# EAGLE schematic sbc (EAGLE 7.5.0)
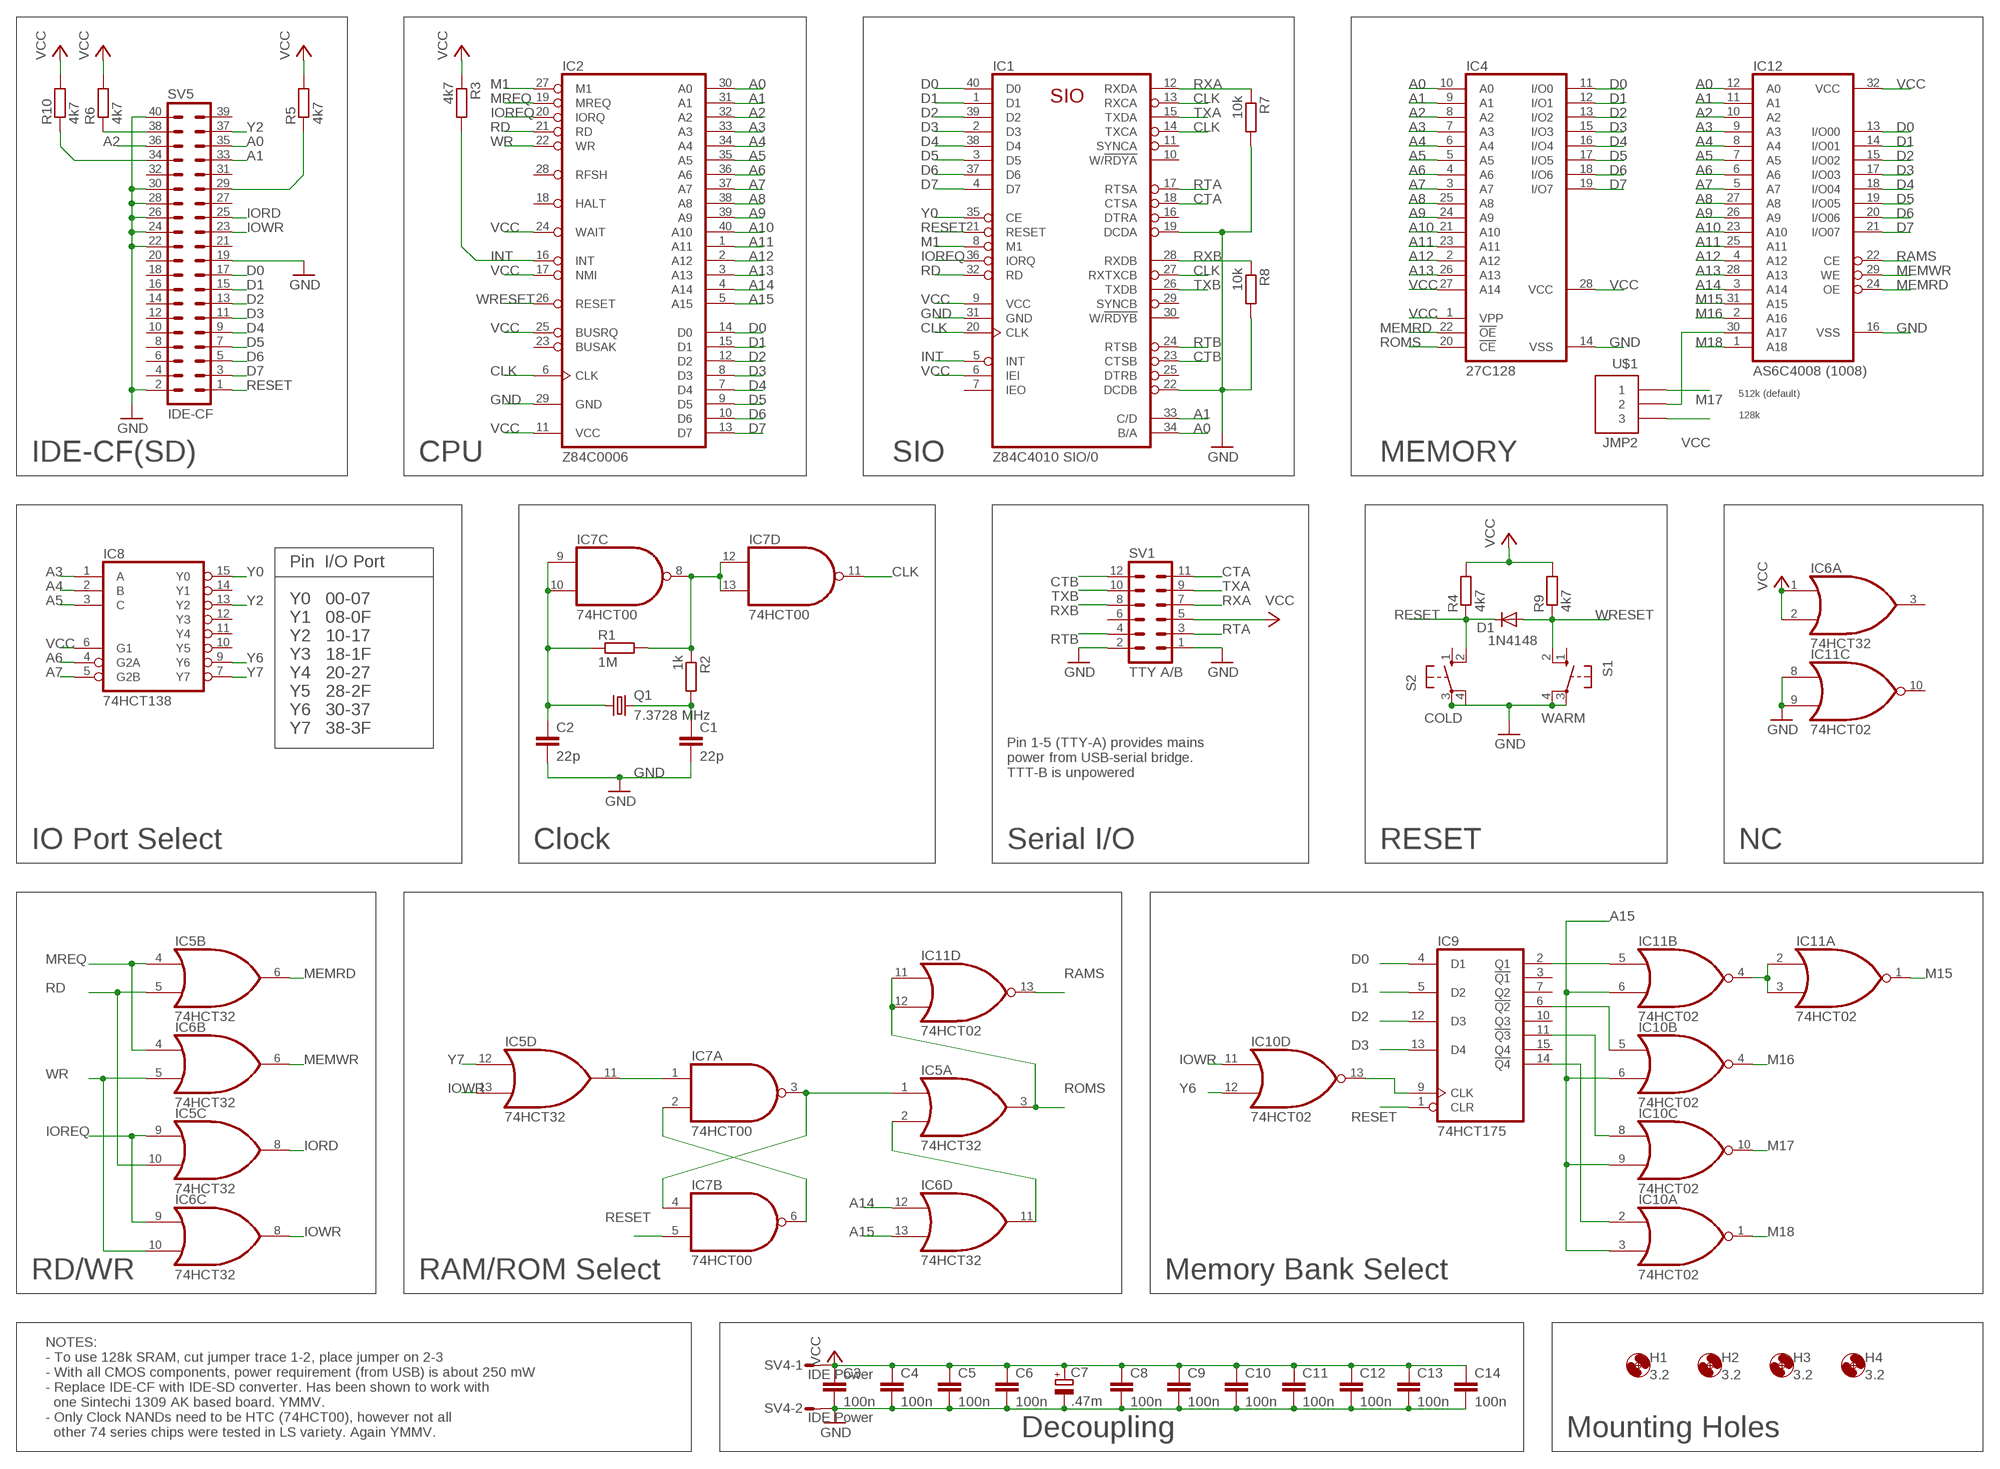
[diagram p0: schematic, sheet 1]

## Parts
C1  22p  C-EU025-024X044  [C025-024X044]
C2  22p  C-EU025-024X044  [C025-024X044]
C3  100n  C-EU050-025X075  [C050-025X075]
C4  100n  C-EU050-025X075  [C050-025X075]
C5  100n  C-EU050-025X075  [C050-025X075]
C6  100n  C-EU050-025X075  [C050-025X075]
C7  .47m  CPOL-EUE2,5-6E  [E2,5-6E]
C8  100n  C-EU050-025X075  [C050-025X075]
C9  100n  C-EU050-025X075  [C050-025X075]
C10  100n  C-EU050-025X075  [C050-025X075]
C11  100n  C-EU050-025X075  [C050-025X075]
C12  100n  C-EU050-025X075  [C050-025X075]
C13  100n  C-EU050-025X075  [C050-025X075]
C14  100n  C-EU050-025X075  [C050-025X075]
D1  1N4148  1N4148DO35-7  [DO35-7]
H1  3.2  MOUNT-HOLE3.2  [3,2]
H2  3.2  MOUNT-HOLE3.2  [3,2]
H3  3.2  MOUNT-HOLE3.2  [3,2]
H4  3.2  MOUNT-HOLE3.2  [3,2]
IC1  Z84C4010 SIO/0  Z80SIO  [DIL40]
IC2  Z84C0006  Z80CPU  [DIL40]
IC4  27C128  27C256AG  [DIL28-6]
IC5  74HCT32  74LS32N  [DIL14]
IC6  74HCT32  74LS32N  [DIL14]
IC7  74HCT00  74LS00N  [DIL14]
IC8  74HCT138  74LS138N  [DIL16]
IC9  74HCT175  74LS175N  [DIL16]
IC10  74HCT02  74LS02N  [DIL14]
IC11  74HCT02  74LS02N  [DIL14]
IC12  AS6C4008 (1008)  HM628512A_DIL32  [DIL32]
Q1  7.3728 MHz  CRYSTALHC49U-V  [HC49U-V]
R1  1M  R-EU_0207/10  [0207/10]
R2  1k  R-EU_0207/10  [0207/10]
R3  4k7  R-EU_0207/10  [0207/10]
R4  4k7  R-EU_0207/10  [0207/10]
R5  4k7  R-EU_0207/10  [0207/10]
R6  4k7  R-EU_0207/10  [0207/10]
R7  10k  R-EU_0207/10  [0207/10]
R8  10k  R-EU_0207/10  [0207/10]
R9  4k7  R-EU_0207/10  [0207/10]
R10  4k7  R-EU_0207/10  [0207/10]
S1  WARM  10-XX  [B3F-10XX]
S2  COLD  10-XX  [B3F-10XX]
SV1  TTY A/B  MA06-2  [MA06-2]
SV4  IDE Power  S02P  [S02P]
SV5  IDE-CF  MA20-2  [MA20-2]
U$1  JMP2  [JUMP2]

## Nets
A0: IC1.34(B/A) IC2.30(A0) IC4.10(A0) IC12.12(A0) SV5.35
A1: IC1.33(C/D) IC2.31(A1) IC4.9(A1) IC12.11(A1) SV5.33
A2: IC2.32(A2) IC4.8(A2) IC12.10(A2) SV5.36
A3: IC2.33(A3) IC4.7(A3) IC8.1(A) IC12.9(A3)
A4: IC2.34(A4) IC4.6(A4) IC8.2(B) IC12.8(A4)
A5: IC2.35(A5) IC4.5(A5) IC8.3(C) IC12.7(A5)
A6: IC2.36(A6) IC4.4(A6) IC8.4(G2A) IC12.6(A6)
A7: IC2.37(A7) IC4.3(A7) IC8.5(G2B) IC12.5(A7)
A8: IC2.38(A8) IC4.25(A8) IC12.27(A8)
A9: IC2.39(A9) IC4.24(A9) IC12.26(A9)
A10: IC2.40(A10) IC4.21(A10) IC12.23(A10)
A11: IC2.1(A11) IC4.23(A11) IC12.25(A11)
A12: IC2.2(A12) IC4.2(A12) IC12.4(A12)
A13: IC2.3(A13) IC4.26(A13) IC12.28(A13)
A14: IC2.4(A14) IC6.12(D:I0) IC12.3(A14)
A15: IC2.5(A15) IC6.13(D:I1) IC10.3(A:I1) IC10.6(B:I1) IC10.9(C:I1) IC11.6(B:I1)
CLK: IC1.13(RXCA) IC1.14(TXCA) IC1.20(CLK) IC1.27(RXTXCB) IC2.6(CLK) IC7.11(D:O)
CTA: IC1.18(CTSA) SV1.11
CTB: IC1.23(CTSB) SV1.12
D0: IC1.40(D0) IC2.14(D0) IC4.11(I/O0) IC9.4(D1) IC12.13(I/O00) SV5.17
D1: IC1.1(D1) IC2.15(D1) IC4.12(I/O1) IC9.5(D2) IC12.14(I/O01) SV5.15
D2: IC1.39(D2) IC2.12(D2) IC4.13(I/O2) IC9.12(D3) IC12.15(I/O02) SV5.13
D3: IC1.2(D3) IC2.8(D3) IC4.15(I/O3) IC9.13(D4) IC12.17(I/O03) SV5.11
D4: IC1.38(D4) IC2.7(D4) IC4.16(I/O4) IC12.18(I/O04) SV5.9
D5: IC1.3(D5) IC2.9(D5) IC4.17(I/O5) IC12.19(I/O05) SV5.7
D6: IC1.37(D6) IC2.10(D6) IC4.18(I/O6) IC12.20(I/O06) SV5.5
D7: IC1.4(D7) IC2.13(D7) IC4.19(I/O7) IC12.21(I/O07) SV5.3
GND [power]: C1.2 C2.2 C3.2 C4.2 C5.2 C6.2 C7.- C8.2 C9.2 C10.2 C11.2 C12.2 C13.2 C14.2 IC1.19(DCDA) IC1.22(DCDB) IC1.31(GND) IC2.29(GND) IC4.14(VSS) IC11.8(C:I0) IC11.9(C:I1) IC12.16(VSS) R7.2 R8.2 S1.3(P) S1.4(P1) S2.3(P) S2.4(P1) SV1.1 SV1.2 SV4.2 SV5.2 SV5.19 SV5.22 SV5.24 SV5.26 SV5.28 SV5.30 SV5.40
INT: IC1.5(INT) IC2.16(INT) R3.2
IORD: IC5.8(C:O) SV5.25
IOREQ: IC1.36(IORQ) IC2.20(IORQ) IC5.9(C:I0) IC6.9(C:I0)
IOWR: IC5.13(D:I1) IC6.8(C:O) IC10.11(D:I0) SV5.23
M1: IC1.8(M1) IC2.27(M1)
M15: IC11.1(A:O) IC12.31(A15)
M16: IC10.4(B:O) IC12.2(A16)
M17: IC10.10(C:O) U$1.1
M18: IC10.1(A:O) IC12.1(A18)
MEMRD: IC4.22(!OE) IC5.6(B:O) IC12.24(OE)
MEMWR: IC6.6(B:O) IC12.29(WE)
MREQ: IC2.19(MREQ) IC5.4(B:I0) IC6.4(B:I0)
N$1: IC9.6(!Q2) IC10.5(B:I0)
N$2: IC9.2(Q1) IC11.5(B:I0)
N$3: IC7.2(A:I1) IC7.6(B:O)
N$4: IC5.11(D:O) IC7.1(A:I0)
N$5: C2.1 IC7.9(C:I0) IC7.10(C:I1) Q1.1 R1.1
N$6: C1.1 Q1.2 R2.2
N$7: IC5.2(A:I1) IC6.11(D:O)
N$8: IC5.1(A:I0) IC7.3(A:O) IC7.4(B:I0)
N$9: IC7.8(C:O) IC7.12(D:I0) IC7.13(D:I1) R1.2 R2.1
N$10: IC9.11(!Q3) IC10.8(C:I0)
N$11: IC9.14(!Q4) IC10.2(A:I0)
N$13: IC11.2(A:I0) IC11.3(A:I1) IC11.4(B:O)
N$16: IC12.30(A17) U$1.2
N$18: IC9.9(CLK) IC10.13(D:O)
N$28: R6.1 SV5.38
N$29: R10.1 SV5.34
N$30: R5.1 SV5.29
RAMS: IC11.13(D:O) IC12.22(CE)
RD: IC1.32(RD) IC2.21(RD) IC5.5(B:I1) IC5.10(C:I1)
RESET: D1.C IC1.21(RESET) IC7.5(B:I1) IC9.1(CLR) R4.1 S2.2(S1) SV5.1
ROMS: IC4.20(!CE) IC5.3(A:O) IC11.11(D:I0) IC11.12(D:I1)
RTA: IC1.17(RTSA) SV1.3
RTB: IC1.24(RTSB) SV1.4
RXA: IC1.12(RXDA) R7.1 SV1.7
RXB: IC1.28(RXDB) R8.1 SV1.8
TXA: IC1.15(TXDA) SV1.9
TXB: IC1.26(TXDB) SV1.10
VCC [power]: C3.1 C4.1 C5.1 C6.1 C7.+ C8.1 C9.1 C10.1 C11.1 C12.1 C13.1 C14.1 IC1.6(IEI) IC1.9(VCC) IC2.11(VCC) IC2.17(NMI) IC2.24(WAIT) IC2.25(BUSRQ) IC4.1(VPP) IC4.27(A14) IC4.28(VCC) IC6.1(A:I0) IC6.2(A:I1) IC8.6(G1) IC12.32(VCC) R3.1 R4.2 R5.2 R6.2 R9.2 R10.2 SV1.5 SV4.1 U$1.3
WR: IC2.22(WR) IC6.5(B:I1) IC6.10(C:I1)
WRESET: D1.A IC2.26(RESET) R9.1 S1.2(S1)
Y0: IC1.35(CE) IC8.15(Y0)
Y2: IC8.13(Y2) SV5.37
Y6: IC8.9(Y6) IC10.12(D:I1)
Y7: IC5.12(D:I0) IC8.7(Y7)
Unconnected: IC1.7(IEO) IC1.10(W/!RDYA) IC1.11(SYNCA) IC1.16(DTRA) IC1.25(DTRB) IC1.29(SYNCB) IC1.30(W/!RDYB) IC2.18(HALT) IC2.23(BUSAK) IC2.28(RFSH) IC6.3(A:O) IC8.10(Y5) IC8.11(Y4) IC8.12(Y3) IC8.14(Y1) IC9.3(!Q1) IC9.7(Q2) IC9.10(Q3) IC9.15(Q4) IC11.10(C:O) S1.1(S) S2.1(S) SV1.6 SV5.4 SV5.6 SV5.8 SV5.10 SV5.12 SV5.14 SV5.16 SV5.18 SV5.20 SV5.21 SV5.27 SV5.31 SV5.32 SV5.39

## Notes on the sheet
- 512k (default)
  
  128k
- IDE-CF(SD) | CPU | SIO | MEMORY
- Pin  I/O Port
  
  Y0   00-07
  Y1   08-0F
  Y2   10-17
  Y3   18-1F
  Y4   20-27
  Y5   28-2F
  Y6   30-37
  Y7   38-3F
- Pin 1-5 (TTY-A) provides mains 
  power from USB-serial bridge.
  TTT-B is unpowered
- IO Port Select | Clock | Serial I/O | RESET | NC
- RD/WR | RAM/ROM Select | Memory Bank Select
- NOTES:
  - To use 128k SRAM, cut jumper trace 1-2, place jumper on 2-3
  - With all CMOS components, power requirement (from USB) is about 250 mW
  - Replace IDE-CF with IDE-SD converter. Has been shown to work with 
    one Sintechi 1309 AK based board. YMMV.
  - Only Clock NANDs need to be HTC (74HCT00), however not all
    other 74 series chips were tested in LS variety. Again YMMV.
- Decoupling | Mounting Holes

## Power pins joined to a net without a drawn wire
GND: IC5.7(P:GND) IC6.7(P:GND) IC7.7(P:GND) IC8.8(GND) IC9.8(GND) IC10.7(P:GND) IC11.7(P:GND)
VCC: IC5.14(P:VCC) IC6.14(P:VCC) IC7.14(P:VCC) IC8.16(VCC) IC9.16(VCC) IC10.14(P:VCC) IC11.14(P:VCC)

## Library data of the parts
C1-C6 C8-C14 = resistor:C-EU: CAPACITOR, European symbol
C7 = resistor:CPOL-EU: POLARIZED CAPACITOR, European symbol
D1 = diode:1N4148: DIODE high speed (Philips)
H1-H4 = holes:MOUNT-HOLE: MOUNTING HOLE with drill center marker
IC1 = zilog:Z80SIO: Z80 FAMILY DEVICE
IC2 = zilog:Z80CPU: Z80 FAMILY DEVICE
IC4 = memory-hitachi:27C256AG: MEMORY; OC_FARNELL: unknown; OC_NEWARK: unknown
IC5 IC6 = 74xx-us:74*32: Quad 2-input OR gate
IC7 = 74xx-us:74*00: Quad 2-input NAND gate
IC8 = 74xx-us:74*138: 3-line to 8-line DECODER/DEMULTIPLEXER
IC9 = 74xx-us:74*175: Qadruple D type FLIP FLOP, clear
IC10 IC11 = 74xx-us:74*02: Quad 2-input NOR gate
IC12 = hitachi_sram_hm628512a-series_rev1:HM628512A_DIL32: 4M SRAM 512kword x 8bit
Q1 = crystal:CRYSTAL: CRYSTAL; OC_FARNELL: 1666969; OC_NEWARK: unknown
R1-R10 = resistor:R-EU_: RESISTOR, European symbol
S1 S2 = switch-omron:10-XX: OMRON SWITCH; MPN: B3F-1000; OC_FARNELL: 176432; OC_NEWARK: 36M3542
SV1 = con-lstb:MA06-2: PIN HEADER; OC_FARNELL: unknown; OC_NEWARK: unknown
SV4 = con-amp-mt:S02P: AMP MT CONNECTOR; OC_FARNELL: unknown; OC_NEWARK: unknown
SV5 = con-lstb:MA20-2: PIN HEADER; OC_FARNELL: unknown; OC_NEWARK: unknown
U$1 = jmp1-2:JMP2

## Net classes
0 default: width 0.305 mm
1 power: width 0.762 mm